# EAGLE design plugstrip (EAGLE 7.4.0)
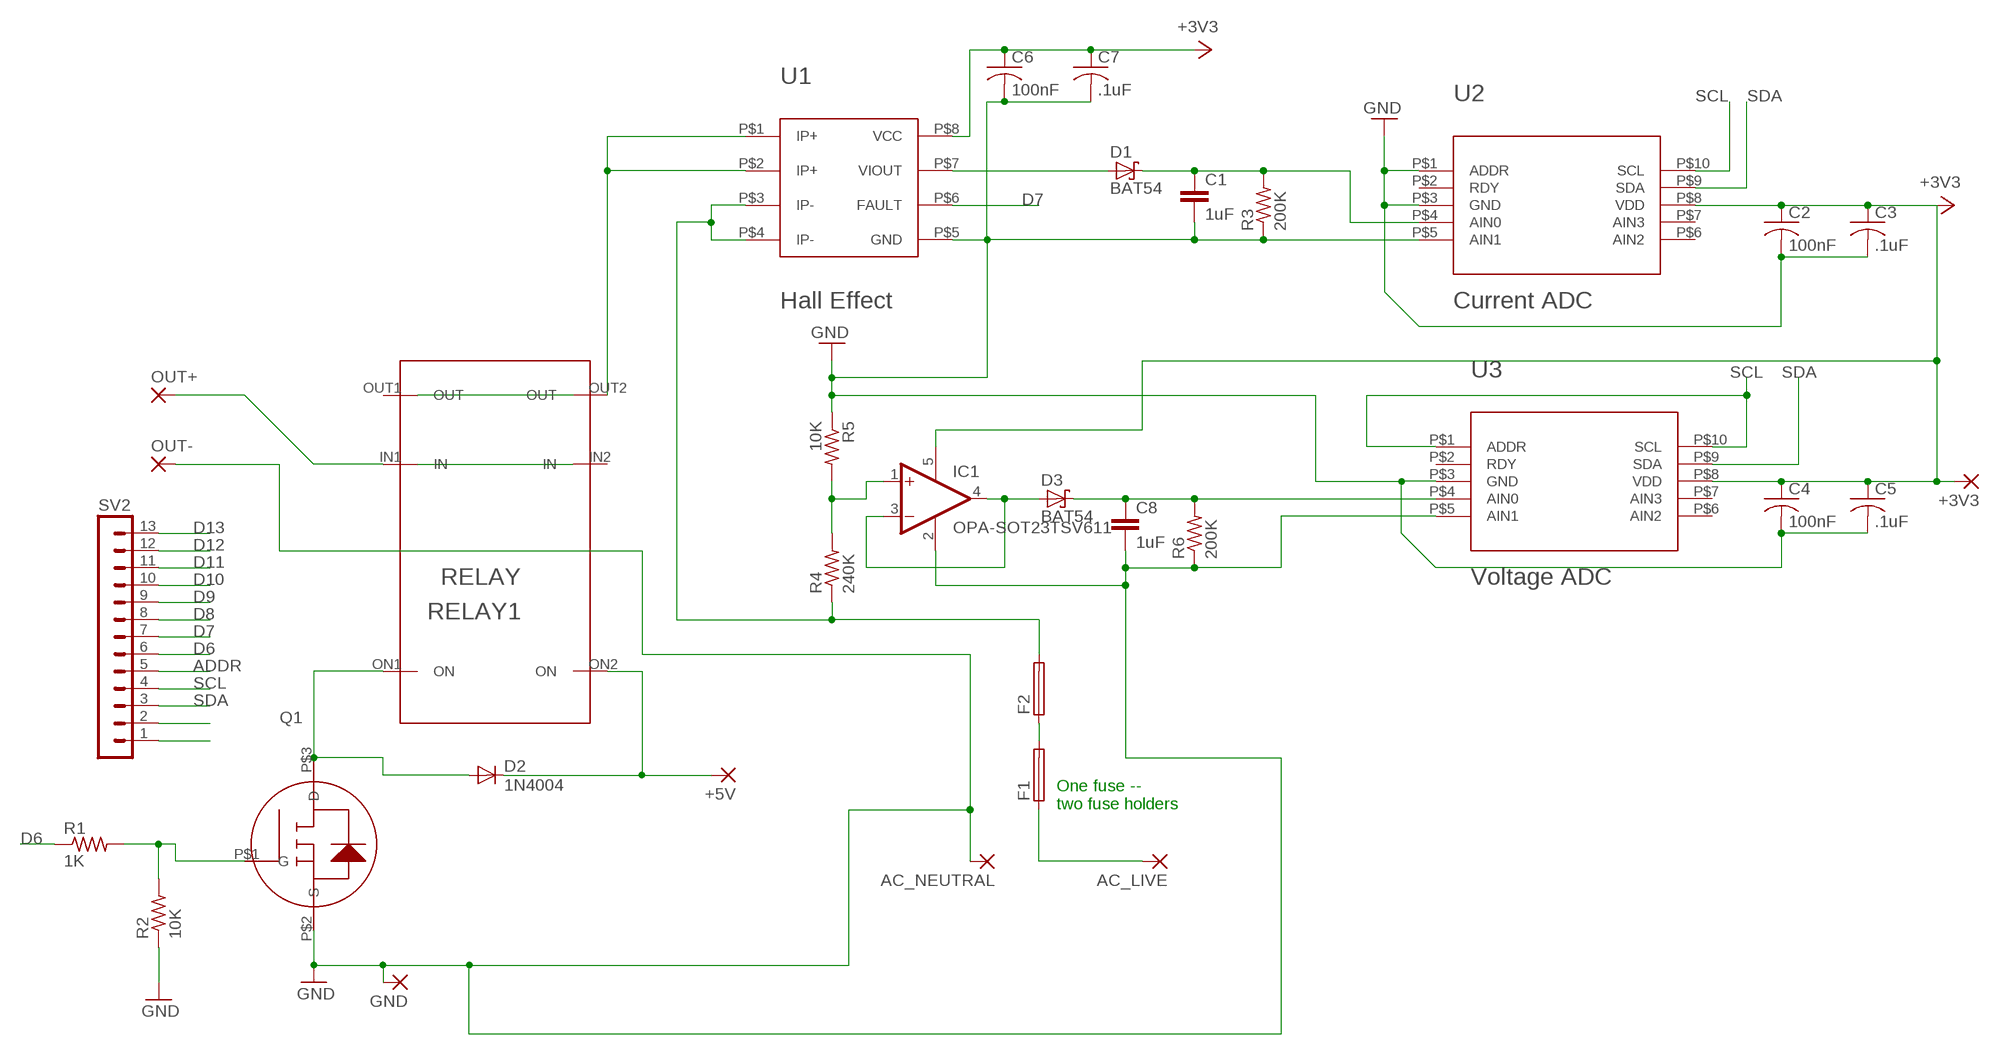
[diagram p0: schematic, sheet 1]

## Parts
+3V3  3,81/1,4  [3,81/1,4]
+5V  3,81/1,4  [3,81/1,4]
AC_LIVE  3,81/1,4  [3,81/1,4]
AC_NEUTRAL  3,81/1,4  [3,81/1,4]
C1  1uF  CSR215E105  [C2.5-2]
C2  100nF  C-USC1206  [C1206]
C3  .1uF  C-USC1206  [C1206]
C4  100nF  C-USC1206  [C1206]
C5  .1uF  C-USC1206  [C1206]
C6  100nF  C-USC1206  [C1206]
C7  .1uF  C-USC1206  [C1206]
C8  1uF  CSR215E105  [C2.5-2]
D1  BAT54  [SOT23]
D2  1N4004  [DO41-10]
D3  BAT54  [SOT23]
F1  19560  [19560]
F2  19560  [19560]
GND  3,81/1,4  [3,81/1,4]
IC1  OPA-SOT23TSV611  [SOT23-5]
OUT+  3,81/1,4  [3,81/1,4]
OUT-  3,81/1,4  [3,81/1,4]
Q1  BSH105  [SOT23]
R1  1K  R-US_CT14J  [0411/15]
R2  10K  R-US_CT14J  [0411/15]
R3  200K  R-US_CT14J  [0411/15]
R4  240K  R-US_0411/15  [0411/15]
R5  10K  R-US_0411/15  [0411/15]
R6  200K  R-US_CT14J  [0411/15]
RELAY1  RELAY  G5RL-1A-E-HR  [G5RL-1A-E-HR]
SV2  MA13-1  [MA13-1]
U1  Hall Effect  ACS711LC  [ACS711]
U2  Current ADC  ADS1013IDGST  [ADS1013]
U3  Voltage ADC  ADS1013IDGST  [ADS1013]

## Nets
+3V3: +3V3.1(P) C2.1 C3.1 C4.1 C5.1 C6.1 C7.1 IC1.5(V+) U1.P$8(VCC) U2.P$8(VDD) U3.P$8(VDD)
AC_LIVE [analoghot]: F2.2 R4.1 U1.P$3(IP-) U1.P$4(IP-)
ADDR: SV2.5
D6: R1.1 SV2.6
D7: SV2.7 U1.P$6(FAULT)
D8: SV2.8
D9: SV2.9
D10: SV2.10
D11: SV2.11
D12: SV2.12
D13: SV2.13
GND: AC_NEUTRAL.1(P) C1.2 C2.2 C3.2 C4.2 C5.2 C6.2 C7.2 C8.2 GND.1(P) IC1.2(V-) OUT-.1(P) Q1.P$2(S) R2.1 R3.1 R5.1 R6.1 U1.P$5(GND) U2.P$1(ADDR) U2.P$3(GND) U2.P$5(AIN1) U3.P$3(GND) U3.P$5(AIN1)
N$1 [analoghot]: OUT+.1(P) RELAY1.IN1(IN)
N$3: F1.2 F2.1
N$4: D2.A Q1.P$3(D) RELAY1.ON1(ON)
N$5: C1.1 D1.3(C) R3.2 U2.P$4(AIN0)
N$6: Q1.P$1(G) R1.2 R2.2
N$7: D1.1(A) U1.P$7(VIOUT)
N$9: SV2.1
N$10: SV2.2
N$12: +5V.1(P) D2.C RELAY1.ON2(ON)
N$13 [analoghot]: RELAY1.OUT2(OUT) U1.P$1(IP+) U1.P$2(IP+)
N$14 [analoghot]: AC_LIVE.1(P) F1.1
N$15: C8.1 D3.3(C) R6.2 U3.P$4(AIN0)
N$17: D3.1(A) IC1.3(-IN) IC1.4(OUT)
N$31: IC1.1(+IN) R4.2 R5.2
SCL: SV2.4 U2.P$10(SCL) U3.P$1(ADDR) U3.P$10(SCL)
SDA: SV2.3 U2.P$9(SDA) U3.P$9(SDA)
Unconnected: RELAY1.IN2(IN) RELAY1.OUT1(OUT) U2.P$2(RDY) U2.P$6(AIN2) U2.P$7(AIN3) U3.P$2(RDY) U3.P$6(AIN2) U3.P$7(AIN3)

## Notes on the sheet
- One fuse -- 
  two fuse holders

## Library data of the parts
+3V3 +5V AC_LIVE AC_NEUTRAL GND OUT+ OUT- = wirepad:3,81/1,4: THROUGH-HOLE PAD
C1 C8 = jackIdd:C: CAPACITOR naming: grid - package width
C2-C7 = rcl:C-US: CAPACITOR, American symbol
D1 D3 = diode:BAT54: Schottky Diodes Source: Fairchild .. BAT54.pdf
D2 = diode:1N4004: DIODE general purpose rectifier, 1 A
F1 F2 = fuse:19560: FUSE HOLDER TR5, Wickmann; MPN: 56000001009; OC_FARNELL: 1185363; OC_NEWARK: 15P8392
IC1 = linear:OPA*-SOT23: Single Operational Amplifier Low Power, Single-Supply, Rail-To-Rail Operational Amplifier Source: http://focus.ti.com/lit/ds/symlink/opa2345.pdf
Q1 = jackIdd:BSH105: IDD Custom Part
R1-R6 = jackIdd:R-US_: RESISTOR, American symbol
RELAY1 = iddproject:G5RL-1A-E-HR
SV2 = con-lstb:MA13-1: PIN HEADER; OC_FARNELL: unknown; OC_NEWARK: unknown
U1 = iddproject:ACS711LC: ACS711 Hall Effect Sensor http://www.digikey.com/product-detail/en/ACS711ELCTR-25AB-T/620-1371-1-ND/2470595
U2 U3 = iddproject:ADS1013IDGST: ADS1013 IDGST analog-digital converter http://www.ti.com/lit/ds/symlink/ads1013.pdf http://www.digikey.com/product-detail/en/ADS1013IDGST/296-25225-1-ND/2174995

## Net classes
0 default: width 0.406 mm, clearance 0.305 mm
1 analoghot: width 4.597 mm, clearance 0.61 mm

## Board
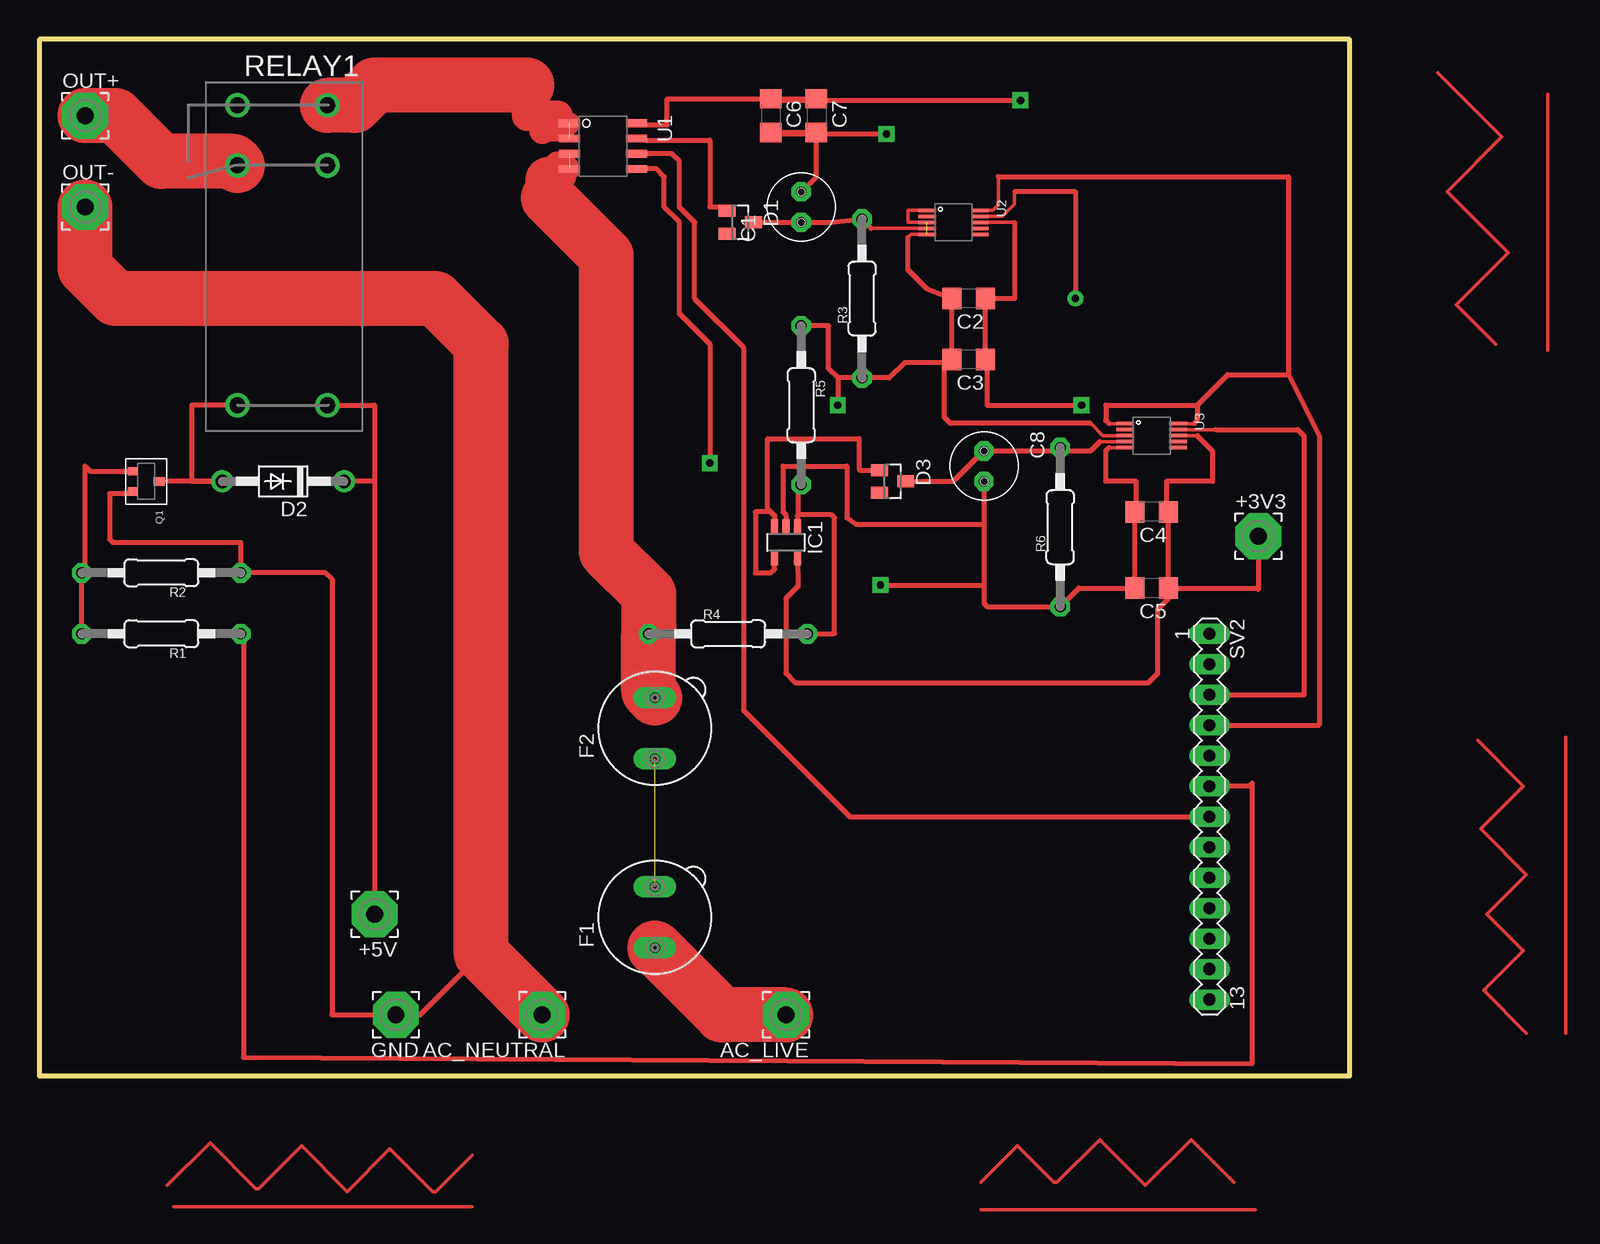
[diagram p1: board, top side]
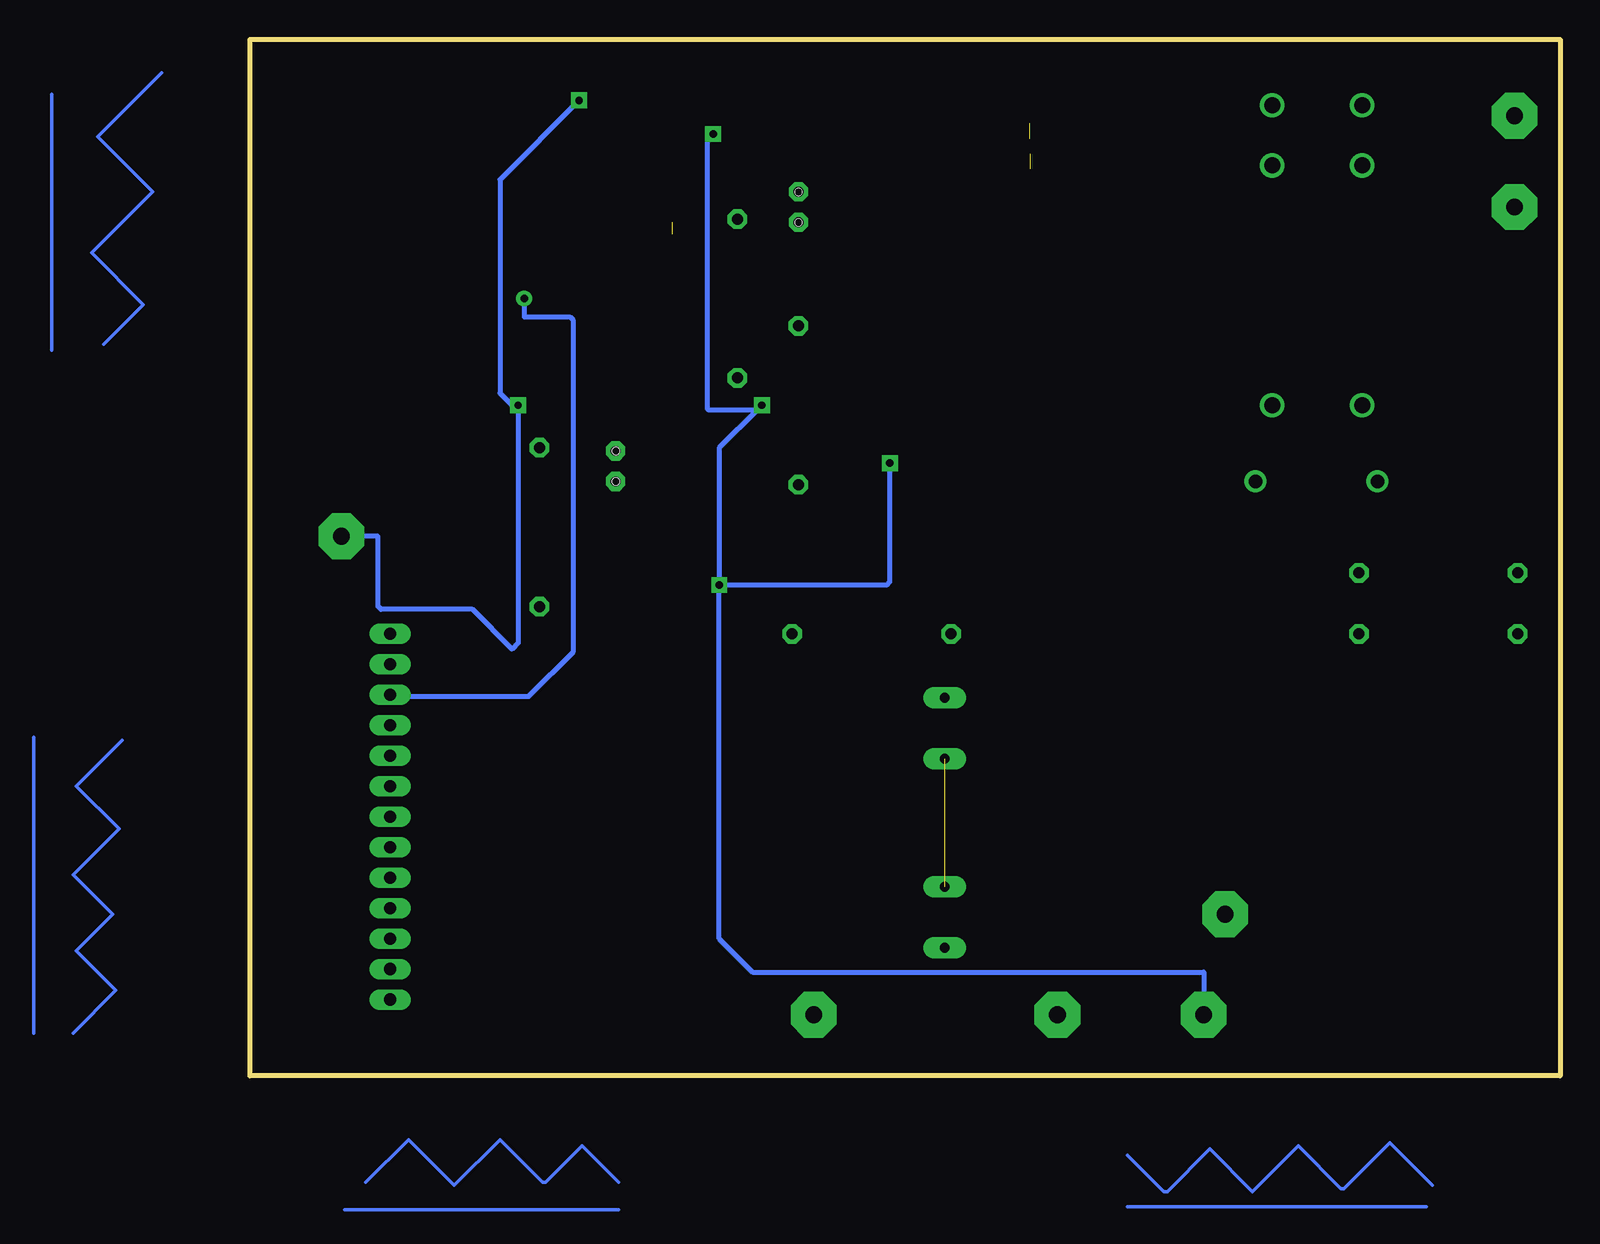
[diagram p2: board, bottom side, seen from below]

Size 109.22 x 86.36 mm. Coordinates in mm from the lower left corner, seen from the top.
Outline: 0,0 109.22,0 109.22,86.36 0,86.36 0,0
Copper layers (1*16): Top 0.035mm / dielectric 1.5mm / Bottom 0.035mm
Design rules "default *": minimum track width 10mil, minimum drill 24mil, track to track 8mil, track to pad 8mil, pad to pad 8mil, via to via 8mil, smd to smd 8mil, copper to edge 40mil, drill to drill 8mil, minimum pad ring 14mil, minimum via ring 14mil, stop-mask expansion 4mil, vias tented up to drill 0mil, thermal gap 10mil

### Footprints (pad centres in the part's own frame; a part is rotated, then mirrored left to right if it is on the bottom)
3,81/1,4 = drill 1.397 pad 3.81 octagon: 1 0,0
C2.5-2 = drill 0.813 pad 1.6 octagon: 1 -1.27,0; 2 1.27,0 | hole 0.6: -1.27,0; 1.27,0
C1206 = smd 1.6 x 1.8: 1 -1.4,0; 2 1.4,0
SOT23 = smd 1 x 1.4: 1 -0.95,-1.1; 2 0.95,-1.1; 3 0,1.1
DO41-10 = drill 1.118: A 5.08,0; C -5.08,0
19560 = drill 0.813 pad 1.778 long: 1 -2.54,0; 2 2.54,0
SOT23-5 = smd 0.6 x 1.2: 1 -0.95,-1.306; 2 0,-1.306; 3 0.95,-1.306; 4 0.95,1.306; 5 -0.95,1.306
SOT23' = smd 0.7 x 0.9: P$1 -0.85,-1.1; P$2 0.85,-1.1; P$3 0,1.1
0411/15 = drill 0.914 octagon: 1 -6.62,0; 2 6.62,0
G5RL-1A-E-HR = drill 1.321: IN1 7.29,5.08; IN2 7.29,-2.413; ON1 -12.7,5.08; ON2 -12.7,-2.413; OUT1 12.294,5.08; OUT2 12.294,-2.413
MA13-1 = drill 1.016 long: 1 -15.24,0; 2 -12.7,0; 3 -10.16,0; 4 -7.62,0; 5 -5.08,0; 6 -2.54,0; 7 0,0; 8 2.54,0; 9 5.08,0; 10 7.62,0; 11 10.16,0; 12 12.7,0; 13 15.24,0
ACS711 = smd 0.65 x 1.75: P$1 -1.905,-2.8; P$2 -0.635,-2.8; P$3 0.635,-2.8; P$4 1.905,-2.8; P$5 1.905,2.8; P$6 0.635,2.8; P$7 -0.635,2.8; P$8 -1.905,2.8
ADS1013 = smd 0.3 x 1.45: P$1 -1,-2.2; P$2 -0.5,-2.2; P$3 0,-2.2; P$4 0.5,-2.2; P$5 1,-2.2; P$6 1,2.2; P$7 0.5,2.2; P$8 0,2.2; P$9 -0.5,2.2; P$10 -1,2.2

### Placement (x,y rotation side)
+3V3  101.6,44.96 0 top
+5V  27.94,13.46 180 top
AC_LIVE  62.23,5.08 180 top
AC_NEUTRAL  41.91,5.08 180 top
C1  63.5,72.39 90 top
C2  77.47,64.77 180 top
C3  77.47,59.69 180 top
C4  92.71,46.99 180 top
C5  92.71,40.64 180 top
C6  60.96,80.01 270 top
C7  64.77,80.01 270 top
C8  78.74,50.8 270 top
D1  58.42,71.12 270 top
D2  20.32,49.53 180 top
D3  71.12,49.53 270 top
F1  51.31,13.21 90 top
F2  51.31,28.96 90 top
GND  29.72,5.08 180 top
IC1  62.23,44.45 180 top
OUT+  3.81,80.01 0 top
OUT-  3.81,72.39 0 top
Q1  [SOT23']  8.89,49.53 270 top
R1  10.16,36.83 180 top
R2  10.16,41.91 180 top
R3  68.58,64.77 90 top
R4  57.4,36.83 0 top
R5  63.5,55.88 270 top
R6  85.09,45.72 90 top
RELAY1  21.59,68.58 90 top
SV2  97.54,21.59 270 top
U1  46.99,77.47 270 top
U2  76.2,71.12 270 top
U3  92.71,53.34 270 top

### Tracks (layer width: path | path; a pad name or v marks a point on that pad's centre or on a via)
+3V3  (via drill 0.61)
  Top 0.305: U2.P$8 81.28,71.12 | U3.P$8 96.52,53.34
  Top 0.406: +3V3.1 101.6,40.64 | 101.6,40.64 101.6,40.51 | C5.1 C4.1 93.98,47.12 93.98,49.53 97.79,49.53 97.79,52.07 96.52,53.34 | 81.28,71.12 81.28,64.77 C2.1 C3.1 78.99,59.57 78.99,55.88 v86.87,55.88 | v81.79,81.28 61.09,81.28 C7.1 C6.1 52.32,81.41 52.32,79.25 49.92,79.25 U1.P$8 | C5.1 101.6,40.64 | IC1.5 63.25,40.79 62.23,39.78 62.23,33.53 62.99,32.77 92.46,32.77 93.22,33.53 93.22,38.86 94.11,39.75 C5.1
  Bottom 0.406: v81.79,81.28 88.39,74.68 88.39,56.9 87.38,55.88 v86.87,55.88 86.87,36.07 87.38,35.56 90.68,38.86 98.3,38.86 98.55,39.12 98.55,44.96 +3V3.1
AC_LIVE  (1 unrouted)
  Top 1.778: U1.P$4 43.81,75.95 43.18,75.95
  Top 2.184: 43.18,75.95 43.69,75.44 43.69,74.93 43.43,74.68 42.42,74.68
  Top 3.81: 42.42,74.68 42.42,73.15
  Top 4.597: 42.42,73.15 47.24,68.33 47.24,43.69 50.78,40.15 R4.1 50.78,32.02 F2.2
D6
  Top 0.406: R1.1 17.02,36.59 17.02,1.52 101.09,1.02 101.09,24.38 100.84,24.13 SV2.6
D7
  Top 0.406: U1.P$6 52.71,76.83 53.34,76.2 53.34,72.39 54.61,71.12 54.61,64.77 58.67,60.71 58.67,30.48 67.56,21.59 SV2.7
GND  (via drill 0.61)  (1 unrouted)
  Top 0.305: U2.P$5 72.66,70.12 72.39,69.85 | U3.P$5 89.17,52.34 | U3.P$3 88.65,53.34 87.63,54.36 | U2.P$1 73.98,72.14 72.39,72.14 72.39,71.12 U2.P$3
  Top 0.406: 89.17,52.34 88.9,52.07 88.9,49.53 91.44,49.53 91.44,47.12 C4.2 C5.2 86.63,40.64 R6.1 79.01,39.1 78.74,39.37 78.74,40.89 | 72.39,69.85 72.39,67.18 74,65.57 C2.2 C3.2 75.82,59.44 75.44,59.44 | C8.2 78.74,45.97 | 78.74,45.97 78.74,40.89 | U1.P$5 51.44,75.56 52.07,74.93 52.07,72.39 53.34,71.12 53.34,63.5 55.88,60.96 v55.88,51.05 | 78.74,45.97 68.07,45.97 67.31,46.48 67.31,50.8 61.98,50.8 61.98,46.99 62.23,46.74 IC1.2 | Q1.P$2 7.62,48.51 5.84,48.51 5.84,44.7 6.1,44.45 16.76,44.45 16.78,44.43 R2.1 23.88,41.91 24.38,41.4 24.38,5.08 GND.1 31.75,5.08 36.83,10.16 | 75.44,59.44 72.14,59.44 70.85,58.15 R3.1 68.56,58.17 66.55,58.17 | 66.55,58.17 65.79,58.93 65.79,62.48 65.77,62.5 R5.1 | 66.55,58.17 v66.55,55.88 | v70.1,40.89 78.74,40.89 | C1.2 64.77,74.93 C7.2 C6.2 61.08,78.49 v70.61,78.49 | 41.91,4.83 AC_NEUTRAL.1 | 87.63,54.36 75.95,54.36 75.44,54.86 75.44,59.44
  Top 4.597: AC_NEUTRAL.1 36.83,10.16 36.83,60.96 33.02,64.77 6.35,64.77 3.81,67.31 OUT-.1
  Bottom 0.406: v66.55,55.88 66.93,55.5 | 66.93,55.5 70.1,52.32 v70.1,40.89 | v70.61,78.49 71.12,77.98 71.12,55.63 70.99,55.5 66.93,55.5 | v70.1,40.89 56.13,40.89 55.88,41.15 v55.88,51.05 | v70.1,40.89 70.1,11.43 67.31,8.64 29.72,8.64 GND.1
N$1
  Top 4.597: RELAY1.IN1 16.18,76.2 10.16,76.2 6.35,80.01 OUT+.1
N$2
  Top 0.305: 116.59,83.57 121.92,78.23 117.35,73.66 122.43,68.58 118.11,64.26 121.41,60.96
N$3  (1 unrouted)
N$4
  Top 0.406: RELAY1.ON1 12.7,55.88 12.7,49.53 D2.A Q1.P$3
N$5
  Top 0.305: 69.35,70.62 U2.P$4
  Top 0.406: 69.35,70.62 R3.2 68.31,71.39 66.04,71.12 C1.1 D1.3
N$6
  Top 0.406: Q1.P$1 4.23,50.38 3.81,50.8 3.81,42.18 R2.2 R1.2
N$7
  Top 0.406: U1.P$7 50.17,78.1 50.29,78.23 50.55,77.98 55.88,77.98 55.88,72.39 57,72.39 D1.1
N$8
  Top 0.305: 119.89,27.94 123.7,24.13 120.14,20.57 123.95,16.76 120.65,13.46 123.7,10.41 120.4,7.11 123.95,3.56
N$11
  Top 0.305: 127.25,28.19 127.25,3.56
N$12
  Top 0.406: 27.94,49.53 D2.C | RELAY1.ON2 27.94,55.88 27.94,49.53 | 27.94,49.53 +5V.1
N$13  (1 unrouted)
  Top 1.778: U1.P$1 43.55,78.74 41.91,78.74
  Top 2.184: 41.91,78.74 43.18,80.01
  Top 2.54: 43.18,80.01 40.64,80.01 40.64,82.55
  Top 4.597: 40.64,82.55 27.94,82.55 26.26,80.87 RELAY1.OUT2
N$14
  Top 4.597: AC_LIVE.1 56.9,5.08 F1.1
N$15
  Top 0.305: U3.P$4 88.4,52.84
  Top 0.406: D3.3 76.2,49.53 C8.1 84.82,52.07 R6.2 85.36,52.07 87.63,52.07 88.4,52.84
N$16
  Top 0.305: 125.73,81.79 125.73,60.45
N$17
  Top 0.406: 60.96,46.99 59.69,46.99 59.69,41.91 60.96,41.91 61.28,42.23 IC1.4 | D3.1 68.39,50.48 68.33,50.55 68.33,53.09 60.71,53.09 60.71,47.24 60.96,46.99 | IC1.3 61.28,46.67 60.96,46.99
N$18
  Top 0.305: 99.57,-8.89 96.01,-5.33 92.2,-9.14 88.39,-5.33 84.84,-8.89 84.58,-8.89 81.53,-5.84 78.49,-8.89
N$19
  Top 0.305: 10.67,-9.14 14.22,-5.59 18.03,-9.4 18.29,-9.4 21.84,-5.84 25.65,-9.65 29.21,-6.1 32.77,-9.65 33.02,-9.65 36.07,-6.6
N$20
  Top 0.305: 11.18,-10.92 36.07,-10.92
N$21
  Top 0.305: 78.49,-11.18 101.35,-11.18
N$22
  Bottom 0.305: 10.67,-9.14 14.22,-5.59 18.03,-9.4 18.29,-9.4 21.84,-5.84 25.65,-9.65 29.21,-6.1 32.77,-9.65 33.02,-9.65 36.07,-6.6
N$23
  Bottom 0.305: 11.18,-10.92 36.07,-10.92
N$24
  Bottom 0.305: 78.49,-8.89 81.53,-5.84 84.58,-8.89 84.84,-8.89 88.39,-5.33 92.2,-9.14 96.01,-5.33 99.57,-8.89
N$25
  Bottom 0.305: 101.35,-11.18 78.49,-11.18
N$26
  Bottom 0.305: 123.95,3.56 120.4,7.11 123.7,10.41 120.65,13.46 123.95,16.76 120.14,20.57 123.7,24.13 119.89,27.94
N$27
  Bottom 0.305: 127.25,28.19 127.25,3.56
N$28
  Bottom 0.305: 125.73,60.45 125.73,81.79
N$29
  Bottom 0.305: 116.59,83.57 121.92,78.23 117.35,73.66 122.43,68.58 118.11,64.26 121.41,60.96
N$31
  Top 0.406: R4.2 66.29,36.85 66.29,46.48 66.04,46.74 63.25,46.74 | 63.25,46.74 63.18,46.67 IC1.1 | R5.2 63.25,49.01 63.25,46.74
SCL
  Top 0.305: U2.P$10 78.42,72.14 79.5,72.14 79.94,72.57 79.94,74.93 | U3.P$1 89.17,54.34 | U3.P$10 96.25,54.34
  Top 0.406: 79.94,74.93 104.14,74.93 104.14,58.42 | 96.52,55.88 99.06,58.42 104.14,58.42 | 96.52,55.88 96.52,54.61 96.25,54.34 | 96.52,55.88 88.9,55.88 88.9,54.61 89.17,54.34 | 104.14,58.42 106.68,53.34 106.68,29.21 SV2.4
SDA  (via drill 0.61)
  Top 0.305: U2.P$9 80.26,71.63 81.28,72.64 81.28,73.66 | U3.P$9 98.04,53.85
  Top 0.406: v86.36,64.77 86.36,73.66 81.28,73.66 | SV2.3 105.41,31.75 105.41,53.34 104.91,53.84 98.05,53.84 98.04,53.85
  Bottom 0.406: v86.36,64.77 86.36,63.25 82.55,63.25 82.3,62.99 82.3,35.31 85.98,31.62 97.41,31.62 SV2.3